# Altium schematic sheet Sheet1.SchDoc
size A2
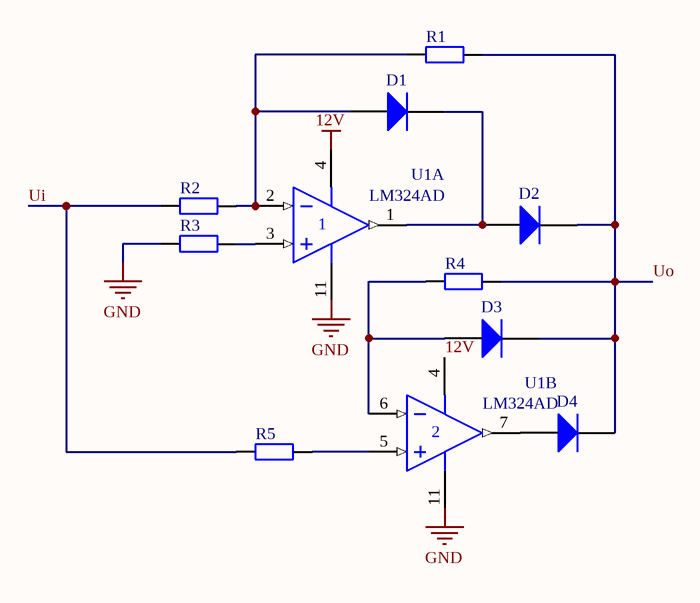
[diagram p0: Sheet1.SchDoc]

## Parts
D1  Diode  [SMC]  (value not drawn)
D2  Diode  [SMC]  (value not drawn)
D3  Diode  [SMC]  (value not drawn)
D4  Diode  [SMC]  (value not drawn)
R1  Res2  [AXIAL-0.4]  (value not drawn)
R2  Res2  [AXIAL-0.4]  (value not drawn)
R3  Res2  [AXIAL-0.4]  (value not drawn)
R4  Res2  [AXIAL-0.4]  (value not drawn)
R5  Res2  [AXIAL-0.4]  (value not drawn)
U1  LM324AD  [SO-14]  (parts A,B of 4)

## Nets
12V: U1.4(V+)
GND: R3.1 U1.11(V-)
Ui: R2.1 R5.1
Uo: D2.2(K) D3.2(K) D4.2(K) R1.2 R4.2
NetD1_1: D1.1(A) R1.1 R2.2 U1.2(IN-)
NetD1_2: D1.2(K) D2.1(A) U1.1(OUT)
NetD3_1: D3.1(A) R4.1 U1.6(IN-)
NetD4_1: D4.1(A) U1.7(OUT)
NetR3_2: R3.2 U1.3(IN+)
NetR5_2: R5.2 U1.5(IN+)

## Library data of the parts
D1-D4 = Diode: Default Diode; Published: 8-Jun-2000; LatestRevisionDate: 17-Jul-2002; LatestRevisionNote: Re-released for DXP Platform.; PackageVersion: Sep-1996; PackageReference: SMC; Publisher: Altium Limited; PackageDescription: DO-214-AB/SMC; 2 C-Bend Leads; Body 7.9 x 5.9 mm, inc. leads (LxW); Code_JEDEC: DO-214-AB
R1-R5 = Res2: Resistor; Value: 1K; Published: 8-Jun-2000; LatestRevisionDate: 17-Jul-2002; LatestRevisionNote: Re-released for DXP Platform.; PackageReference: AXIAL-0.4; Publisher: Altium Limited; PackageDescription: Axial Device, Thru-Hole; 2 Leads; 0.4 in Pin Spacing
U1 = LM324AD: Quadruple Operational Amplifier; Published: 15-Apr-2002; LatestRevisionDate: 4-Mar-2005; LatestRevisionNote: Stylized 3D Model Added.; DatasheetDocument: Jan-1989; PackageDocument: Jan-1998; PackageReference: D014; Publisher: Altium Limited; ComponentLink1Description: Manufacturer Link; ComponentLink1URL: http://www.ti.com/